# Altium schematic sheet Main Page.SchDoc
size 420 x 297 mm; SheetNumber: 2; SheetTotal: 16
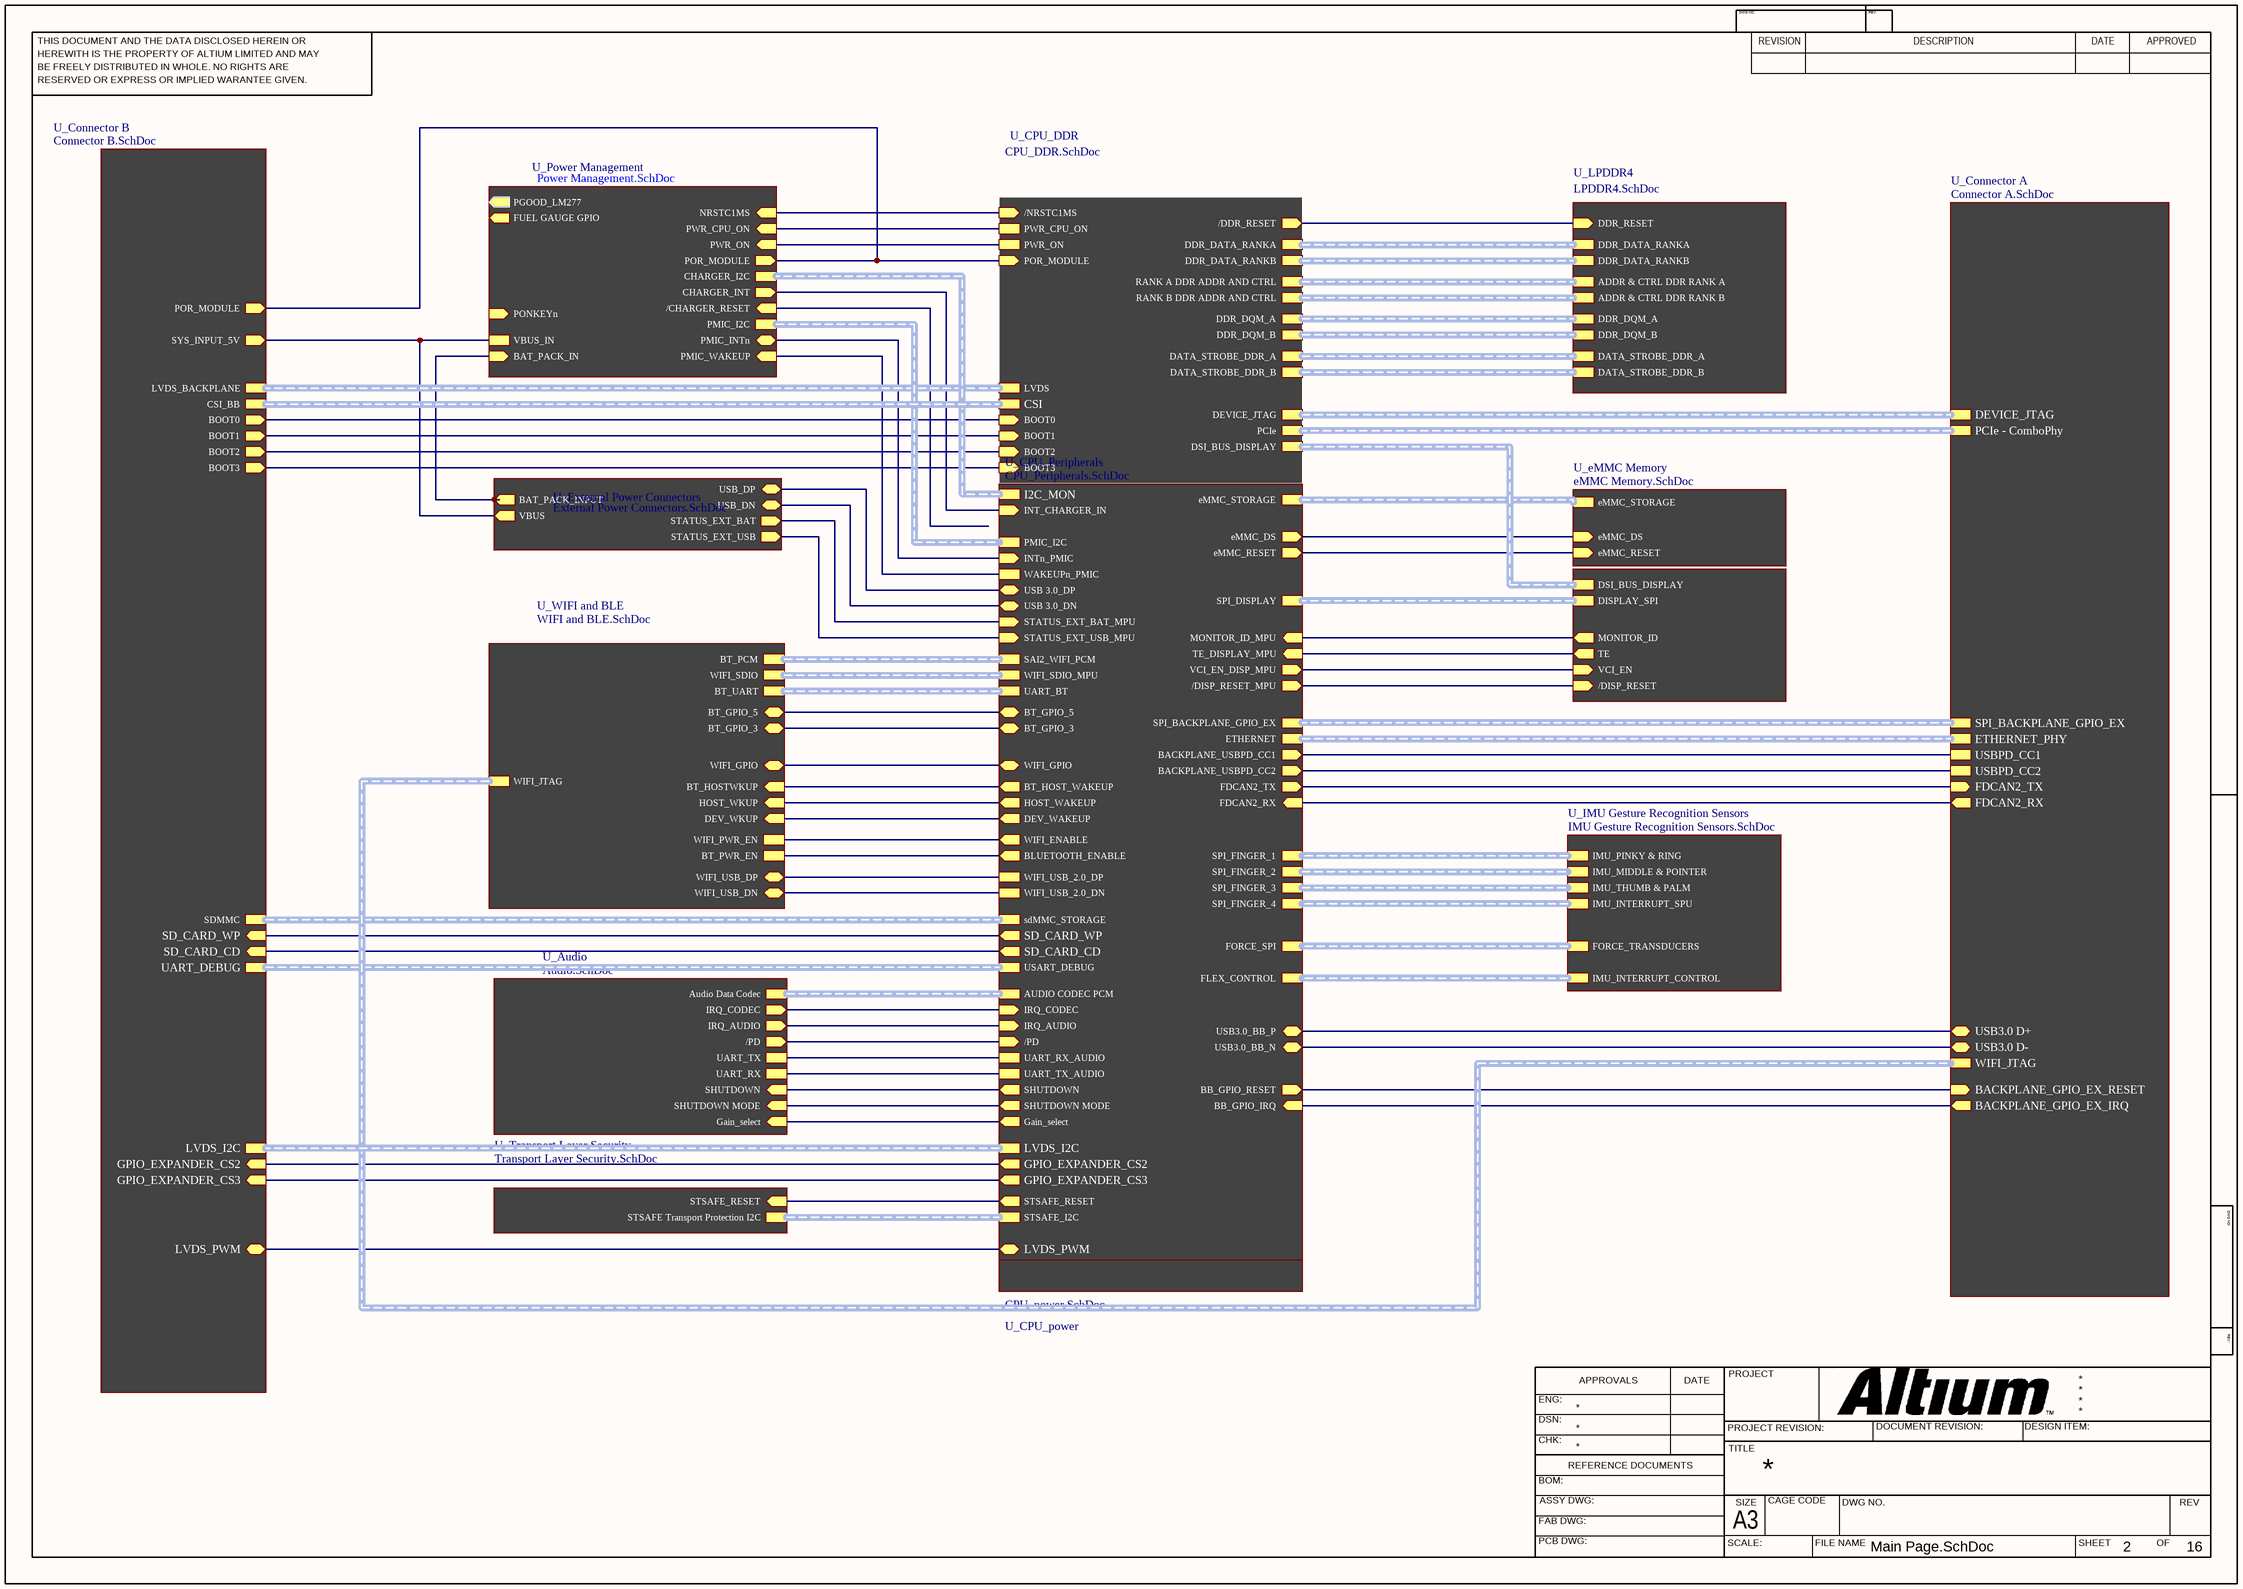
[diagram p0: Main Page.SchDoc]

## Sub-sheets
U_Audio = Audio.SchDoc: UART_TX, UART_RX, Audio Data Codec (harness Audio Data Bus Codec), IRQ_AUDIO (out), SHUTDOWN (in), SHUTDOWN MODE (in), Gain_select (in), /PD (out), IRQ_CODEC (out)
U_Connector A = Connector A.SchDoc: USB3.0 D+ (bidir), USB3.0 D- (bidir), USBPD_CC1, USBPD_CC2, DEVICE_JTAG (harness DEVICE_JTAG), WIFI_JTAG (harness WIFI_JTAG), PCIe - ComboPhy (harness PCIe - ComboPhy), ETHERNET_PHY (harness ETHERNET_PHY), FDCAN2_TX (in), FDCAN2_RX (out), SPI_BACKPLANE_GPIO_EX (harness BACKPLANE_GPIO_EXPANDER_SPI), BACKPLANE_GPIO_EX_RESET (in), BACKPLANE_GPIO_EX_IRQ (out)
U_Connector B = Connector B.SchDoc: SYS_INPUT_5V (out), SDMMC (harness SDMMC), CSI_BB (harness CSI), POR_MODULE (out), BOOT0 (out), BOOT1 (out), BOOT2 (out), BOOT3 (out), LVDS_BACKPLANE, UART_DEBUG (harness UART_DEBUG), SD_CARD_WP (in), SD_CARD_CD (in), LVDS_I2C (harness LVDS_BREAKOUT_I2C), LVDS_PWM (bidir), GPIO_EXPANDER_CS2 (in), GPIO_EXPANDER_CS3 (in)
U_CPU_DDR = CPU_DDR.SchDoc: RANK B DDR ADDR AND CTRL (harness ADDR & CTRL DDR RANK B), RANK A DDR ADDR AND CTRL (harness ADDR & CTRL DDR RANK A), DDR_DATA_RANKB (harness DDR_DATA_RANKB), DDR_DATA_RANKA (harness DDR_DATA_RANKA), /DDR_RESET (out), BOOT0 (in), BOOT1 (in), BOOT2 (in), BOOT3 (in), /NRSTC1MS (in), PWR_CPU_ON, PWR_ON, DSI_BUS_DISPLAY (harness DSI_DISPLAY), PCIe (harness PCIe - ComboPhy), DEVICE_JTAG (harness DEVICE_JTAG), POR_MODULE (in), LVDS (harness LVDS), DDR_DQM_A (harness DDR_DQM_A), DDR_DQM_B (harness DDR_DQM_B), DATA_STROBE_DDR_A (harness DATA_STROBE_DDR_A), DATA_STROBE_DDR_B (harness DATA_STROBE_DDR_B), CSI (harness CSI)
U_CPU_Peripherals = CPU_Peripherals.SchDoc: eMMC_STORAGE (harness eMMC), WIFI_ENABLE (out), BLUETOOTH_ENABLE (out), BT_GPIO_5 (bidir), BT_GPIO_3 (bidir), WIFI_GPIO (bidir), BT_HOST_WAKEUP (out), HOST_WAKEUP (out), DEV_WAKEUP (out), BACKPLANE_USBPD_CC1 (out), BACKPLANE_USBPD_CC2 (out), USB 3.0_DP (bidir), USB 3.0_DN (bidir), sdMMC_STORAGE (harness SDMMC), USART_DEBUG (harness UART_DEBUG), UART_BT (harness UART_BT), ETHERNET (harness ETHERNET_PHY), AUDIO CODEC PCM (harness AUDIO_CODEC_SAI), SPI_FINGER_3 (harness IMU_FINGER3), SPI_FINGER_4 (harness IMU_FINGER4), FORCE_SPI (harness FORCE_TRANSDUCERS), SPI_FINGER_2 (harness IMU_FINGER2), SPI_FINGER_1 (harness IMU_FINGER1), SPI_DISPLAY (harness SPI_DISPLAY), PMIC_I2C (harness I2C_PMIC), WIFI_USB_2.0_DN, WIFI_USB_2.0_DP, FLEX_CONTROL (harness IMU_INTERRUPTS), WAKEUPn_PMIC, INTn_PMIC (in), INT_CHARGER_IN (in), STSAFE_I2C (harness STSAFE Transport Protection I2C), SAI2_WIFI_PCM (harness PCM_WIFI_SAI2), FDCAN2_TX (out), FDCAN2_RX (in), WIFI_SDIO_MPU (harness WIFI_SDIO), IRQ_AUDIO (in), UART_TX_AUDIO, UART_RX_AUDIO, IRQ_CODEC (in), /PD (in), SHUTDOWN (out), SHUTDOWN MODE (out), Gain_select (out), eMMC_DS (out), eMMC_RESET (out), STSAFE_RESET (out), STATUS_EXT_BAT_MPU (in), STATUS_EXT_USB_MPU (in), MONITOR_ID_MPU (in), TE_DISPLAY_MPU (in), VCI_EN_DISP_MPU (out), /DISP_RESET_MPU (out), USB3.0_BB_N (bidir), USB3.0_BB_P (bidir), I2C_MON (harness CHARGER & FUEL GAUGE I2C), SD_CARD_WP (out), SD_CARD_CD (out), LVDS_I2C (harness LVDS_BREAKOUT_I2C), SPI_BACKPLANE_GPIO_EX, BB_GPIO_RESET (out), BB_GPIO_IRQ (in), LVDS_PWM (bidir), GPIO_EXPANDER_CS2 (out), GPIO_EXPANDER_CS3 (out)
U_CPU_power = CPU_power.SchDoc: no entries
U_Display = Display.SchDoc: DSI_BUS_DISPLAY (harness DSI_DISPLAY), MONITOR_ID (out), TE (out), /DISP_RESET (in), VCI_EN (in), DISPLAY_SPI (harness DISPLAY_SPI)
U_eMMC Memory = eMMC Memory.SchDoc: eMMC_STORAGE (harness eMMC), eMMC_DS (in), eMMC_RESET (in)
U_External Power Connectors = External Power Connectors.SchDoc: VBUS (out), USB_DP (bidir), USB_DN (bidir), BAT_PACK_INPUT (out), STATUS_EXT_BAT (out), STATUS_EXT_USB (out)
U_IMU Gesture Recognition Sensors = IMU Gesture Recognition Sensors.SchDoc: IMU_PINKY & RING (harness IMU_FINGER1), IMU_MIDDLE & POINTER (harness IMU_FINGER2), IMU_THUMB & PALM (harness IMU_FINGER3), IMU_INTERRUPT_SPU (harness IMU_FINGER4), FORCE_TRANSDUCERS (harness FORCE_TRANSDUCERS), IMU_INTERRUPT_CONTROL (harness IMU_INTERRUPT_CONTROL)
U_LPDDR4 = LPDDR4.SchDoc: DDR_DATA_RANKB (harness DDR_DATA_RANKB), DDR_DATA_RANKA (harness DDR_DATA_RANKA), ADDR & CTRL DDR RANK A (harness ADDR & CTRL DDR RANK A), ADDR & CTRL DDR RANK B (harness ADDR & CTRL DDR RANK B), DDR_RESET (in), DATA_STROBE_DDR_B (harness DATA_STROBE_DDR), DATA_STROBE_DDR_A (harness DATA_STROBE_DDR), DDR_DQM_B (harness DDR_DQM), DDR_DQM_A (harness DDR_DQM)
U_Power Management = Power Management.SchDoc: PMIC_INTn (bidir), PMIC_WAKEUP (in), PONKEYn (in), PWR_CPU_ON (in), PWR_ON (in), NRSTC1MS (in), PGOOD_LM277 (out), VBUS_IN, CHARGER_INT (out), /CHARGER_RESET (in), BAT_PACK_IN (in), PMIC_I2C (harness PMIC_I2C), POR_MODULE (out), FUEL GAUGE GPIO (out), CHARGER_I2C (harness CHARGER & FUEL GAUGE I2C)
U_Transport Layer Security = Transport Layer Security.SchDoc: STSAFE_RESET (in), STSAFE Transport Protection I2C (harness STSAFE Transport Protection I2C)
U_WIFI and BLE = WIFI and BLE.SchDoc: WIFI_PWR_EN, BT_PWR_EN, BT_PCM (harness BT_PCM), BT_UART (harness BT_UART), BT_GPIO_3 (bidir), BT_GPIO_5 (bidir), BT_HOSTWKUP (in), HOST_WKUP (in), DEV_WKUP (in), WIFI_USB_DP (bidir), WIFI_USB_DN (bidir), WIFI_GPIO (bidir), WIFI_JTAG (harness WIFI_JTAG), WIFI_SDIO (harness WIFI SDIO)

## Nets
(unnamed): sheet U_CPU_DDR//DDR_RESET, sheet U_LPDDR4/DDR_RESET
(unnamed): sheet U_CPU_DDR/BOOT0, sheet U_Connector B/BOOT0
(unnamed): sheet U_CPU_DDR/BOOT1, sheet U_Connector B/BOOT1
(unnamed): sheet U_CPU_DDR/BOOT2, sheet U_Connector B/BOOT2
(unnamed): sheet U_CPU_DDR/BOOT3, sheet U_Connector B/BOOT3
(unnamed): sheet U_CPU_DDR//NRSTC1MS, sheet U_Power Management/NRSTC1MS
(unnamed): sheet U_CPU_DDR/PWR_CPU_ON, sheet U_Power Management/PWR_CPU_ON
(unnamed): sheet U_CPU_DDR/PWR_ON, sheet U_Power Management/PWR_ON
(unnamed): sheet U_CPU_DDR/POR_MODULE, sheet U_Power Management/POR_MODULE, sheet U_Connector B/POR_MODULE
(unnamed): sheet U_Power Management/PMIC_INTn, sheet U_CPU_Peripherals/INTn_PMIC
(unnamed): sheet U_Power Management/PMIC_WAKEUP, sheet U_CPU_Peripherals/WAKEUPn_PMIC
(unnamed): sheet U_Power Management/VBUS_IN, sheet U_Connector B/SYS_INPUT_5V, sheet U_External Power Connectors/VBUS
(unnamed): sheet U_Power Management/CHARGER_INT, sheet U_CPU_Peripherals/INT_CHARGER_IN
(unnamed): sheet U_Power Management/BAT_PACK_IN, sheet U_External Power Connectors/BAT_PACK_INPUT
(unnamed): sheet U_CPU_Peripherals/WIFI_ENABLE, sheet U_WIFI and BLE/WIFI_PWR_EN
(unnamed): sheet U_CPU_Peripherals/BLUETOOTH_ENABLE, sheet U_WIFI and BLE/BT_PWR_EN
(unnamed): sheet U_CPU_Peripherals/BT_GPIO_5, sheet U_WIFI and BLE/BT_GPIO_5
(unnamed): sheet U_CPU_Peripherals/BT_GPIO_3, sheet U_WIFI and BLE/BT_GPIO_3
(unnamed): sheet U_CPU_Peripherals/WIFI_GPIO, sheet U_WIFI and BLE/WIFI_GPIO
(unnamed): sheet U_CPU_Peripherals/BT_HOST_WAKEUP, sheet U_WIFI and BLE/BT_HOSTWKUP
(unnamed): sheet U_CPU_Peripherals/HOST_WAKEUP, sheet U_WIFI and BLE/HOST_WKUP
(unnamed): sheet U_CPU_Peripherals/DEV_WAKEUP, sheet U_WIFI and BLE/DEV_WKUP
(unnamed): sheet U_CPU_Peripherals/BACKPLANE_USBPD_CC1, sheet U_Connector A/USBPD_CC1
(unnamed): sheet U_CPU_Peripherals/BACKPLANE_USBPD_CC2, sheet U_Connector A/USBPD_CC2
(unnamed): sheet U_CPU_Peripherals/USB 3.0_DP, sheet U_External Power Connectors/USB_DP
(unnamed): sheet U_CPU_Peripherals/USB 3.0_DN, sheet U_External Power Connectors/USB_DN
(unnamed): sheet U_CPU_Peripherals/WIFI_USB_2.0_DN, sheet U_WIFI and BLE/WIFI_USB_DN
(unnamed): sheet U_CPU_Peripherals/WIFI_USB_2.0_DP, sheet U_WIFI and BLE/WIFI_USB_DP
(unnamed): sheet U_CPU_Peripherals/FDCAN2_TX, sheet U_Connector A/FDCAN2_TX
(unnamed): sheet U_CPU_Peripherals/FDCAN2_RX, sheet U_Connector A/FDCAN2_RX
(unnamed): sheet U_CPU_Peripherals/IRQ_AUDIO, sheet U_Audio/IRQ_AUDIO
(unnamed): sheet U_CPU_Peripherals/UART_TX_AUDIO, sheet U_Audio/UART_RX
(unnamed): sheet U_CPU_Peripherals/UART_RX_AUDIO, sheet U_Audio/UART_TX
(unnamed): sheet U_CPU_Peripherals/IRQ_CODEC, sheet U_Audio/IRQ_CODEC
(unnamed): sheet U_CPU_Peripherals//PD, sheet U_Audio//PD
(unnamed): sheet U_CPU_Peripherals/SHUTDOWN, sheet U_Audio/SHUTDOWN
(unnamed): sheet U_CPU_Peripherals/SHUTDOWN MODE, sheet U_Audio/SHUTDOWN MODE
(unnamed): sheet U_CPU_Peripherals/Gain_select, sheet U_Audio/Gain_select
(unnamed): sheet U_CPU_Peripherals/eMMC_DS, sheet U_eMMC Memory/eMMC_DS
(unnamed): sheet U_CPU_Peripherals/eMMC_RESET, sheet U_eMMC Memory/eMMC_RESET
(unnamed): sheet U_CPU_Peripherals/STSAFE_RESET, sheet U_Transport Layer Security/STSAFE_RESET
(unnamed): sheet U_CPU_Peripherals/STATUS_EXT_BAT_MPU, sheet U_External Power Connectors/STATUS_EXT_BAT
(unnamed): sheet U_CPU_Peripherals/STATUS_EXT_USB_MPU, sheet U_External Power Connectors/STATUS_EXT_USB
(unnamed): sheet U_CPU_Peripherals/MONITOR_ID_MPU, sheet U_Display/MONITOR_ID
(unnamed): sheet U_CPU_Peripherals/TE_DISPLAY_MPU, sheet U_Display/TE
(unnamed): sheet U_CPU_Peripherals/VCI_EN_DISP_MPU, sheet U_Display/VCI_EN
(unnamed): sheet U_CPU_Peripherals//DISP_RESET_MPU, sheet U_Display//DISP_RESET
(unnamed): sheet U_CPU_Peripherals/USB3.0_BB_N, sheet U_Connector A/USB3.0 D-
(unnamed): sheet U_CPU_Peripherals/USB3.0_BB_P, sheet U_Connector A/USB3.0 D+
(unnamed): sheet U_CPU_Peripherals/SD_CARD_WP, sheet U_Connector B/SD_CARD_WP
(unnamed): sheet U_CPU_Peripherals/SD_CARD_CD, sheet U_Connector B/SD_CARD_CD
(unnamed): sheet U_CPU_Peripherals/BB_GPIO_RESET, sheet U_Connector A/BACKPLANE_GPIO_EX_RESET
(unnamed): sheet U_CPU_Peripherals/BB_GPIO_IRQ, sheet U_Connector A/BACKPLANE_GPIO_EX_IRQ
(unnamed): sheet U_CPU_Peripherals/LVDS_PWM, sheet U_Connector B/LVDS_PWM
(unnamed): sheet U_CPU_Peripherals/GPIO_EXPANDER_CS2, sheet U_Connector B/GPIO_EXPANDER_CS2
(unnamed): sheet U_CPU_Peripherals/GPIO_EXPANDER_CS3, sheet U_Connector B/GPIO_EXPANDER_CS3

## Buses and harness runs
harness sheet U_Audio/Audio Data Codec = sheet U_CPU_Peripherals/AUDIO CODEC PCM
harness sheet U_Connector A/DEVICE_JTAG = sheet U_CPU_DDR/DEVICE_JTAG
harness sheet U_Connector A/ETHERNET_PHY = sheet U_CPU_Peripherals/ETHERNET
harness sheet U_Connector A/PCIe - ComboPhy = sheet U_CPU_DDR/PCIe
harness sheet U_Connector A/SPI_BACKPLANE_GPIO_EX = sheet U_CPU_Peripherals/SPI_BACKPLANE_GPIO_EX
harness sheet U_Connector A/WIFI_JTAG = sheet U_WIFI and BLE/WIFI_JTAG
harness sheet U_Connector B/CSI_BB = sheet U_CPU_DDR/CSI
harness sheet U_Connector B/LVDS_BACKPLANE = sheet U_CPU_DDR/LVDS
harness sheet U_Connector B/LVDS_I2C = sheet U_CPU_Peripherals/LVDS_I2C
harness sheet U_Connector B/SDMMC = sheet U_CPU_Peripherals/sdMMC_STORAGE
harness sheet U_Connector B/UART_DEBUG = sheet U_CPU_Peripherals/USART_DEBUG
harness sheet U_CPU_DDR/DATA_STROBE_DDR_A = sheet U_LPDDR4/DATA_STROBE_DDR_A
harness sheet U_CPU_DDR/DATA_STROBE_DDR_B = sheet U_LPDDR4/DATA_STROBE_DDR_B
harness sheet U_CPU_DDR/DDR_DATA_RANKA = sheet U_LPDDR4/DDR_DATA_RANKA
harness sheet U_CPU_DDR/DDR_DATA_RANKB = sheet U_LPDDR4/DDR_DATA_RANKB
harness sheet U_CPU_DDR/DDR_DQM_A = sheet U_LPDDR4/DDR_DQM_A
harness sheet U_CPU_DDR/DDR_DQM_B = sheet U_LPDDR4/DDR_DQM_B
harness sheet U_CPU_DDR/DSI_BUS_DISPLAY = sheet U_Display/DSI_BUS_DISPLAY
harness sheet U_CPU_DDR/RANK A DDR ADDR AND CTRL = sheet U_LPDDR4/ADDR & CTRL DDR RANK A
harness sheet U_CPU_DDR/RANK B DDR ADDR AND CTRL = sheet U_LPDDR4/ADDR & CTRL DDR RANK B
harness sheet U_CPU_Peripherals/eMMC_STORAGE = sheet U_eMMC Memory/eMMC_STORAGE
harness sheet U_CPU_Peripherals/FLEX_CONTROL = sheet U_IMU Gesture Recognition Sensors/IMU_INTERRUPT_CONTROL
harness sheet U_CPU_Peripherals/FORCE_SPI = sheet U_IMU Gesture Recognition Sensors/FORCE_TRANSDUCERS
harness sheet U_CPU_Peripherals/I2C_MON = sheet U_Power Management/CHARGER_I2C
harness sheet U_CPU_Peripherals/PMIC_I2C = sheet U_Power Management/PMIC_I2C
harness sheet U_CPU_Peripherals/SAI2_WIFI_PCM = sheet U_WIFI and BLE/BT_PCM
harness sheet U_CPU_Peripherals/SPI_DISPLAY = sheet U_Display/DISPLAY_SPI
harness sheet U_CPU_Peripherals/SPI_FINGER_1 = sheet U_IMU Gesture Recognition Sensors/IMU_PINKY & RING
harness sheet U_CPU_Peripherals/SPI_FINGER_2 = sheet U_IMU Gesture Recognition Sensors/IMU_MIDDLE & POINTER
harness sheet U_CPU_Peripherals/SPI_FINGER_3 = sheet U_IMU Gesture Recognition Sensors/IMU_THUMB & PALM
harness sheet U_CPU_Peripherals/SPI_FINGER_4 = sheet U_IMU Gesture Recognition Sensors/IMU_INTERRUPT_SPU
harness sheet U_CPU_Peripherals/STSAFE_I2C = sheet U_Transport Layer Security/STSAFE Transport Protection I2C
harness sheet U_CPU_Peripherals/UART_BT = sheet U_WIFI and BLE/BT_UART
harness sheet U_CPU_Peripherals/WIFI_SDIO_MPU = sheet U_WIFI and BLE/WIFI_SDIO

## Notes on the sheet
- THIS DOCUMENT AND THE DATA DISCLOSED HEREIN OR
- HEREWITH IS THE PROPERTY OF ALTIUM LIMITED AND MAY
- DWG NO:
- REVISION
- REV:
- DESCRIPTION
- DATE
- APPROVED
- BE FREELY DISTRIBUTED IN WHOLE. NO RIGHTS ARE
- RESERVED OR EXPRESS OR IMPLIED WARANTEE GIVEN.
- ENG:
- APPROVALS
- PROJECT
- DSN:
- CHK:
- REFERENCE DOCUMENTS
- PROJECT REVISION:
- TITLE
- DOCUMENT REVISION:
- DESIGN ITEM:
- BOM:
- FAB DWG:
- PCB DWG:
- ASSY DWG:
- SCALE:
- A3
- SIZE
- CAGE CODE
- FILE NAME
- DWG NO.
- SHEET
- OF
- REV